# Altium schematic sheet Calibration.SchDoc
size A4; SheetNumber: 1; SheetTotal: 1
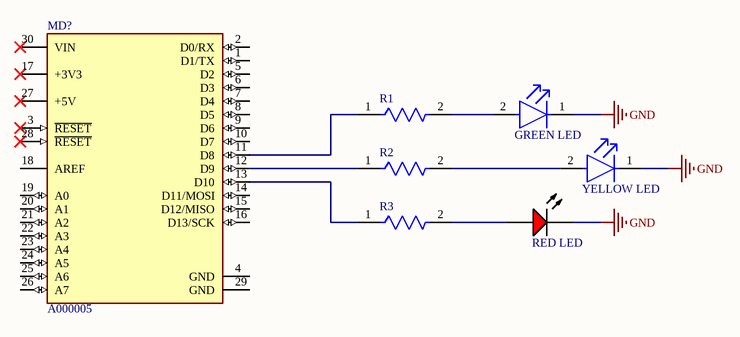
[diagram p0: Calibration.SchDoc]

## Parts
LEDG  GREEN LED  [FP-LTST-C190GKT-MFG]
LEDR  RED LED  [VISH-TLMX1100_V]
LEDY  YELLOW LED  [FP-6_541-5092_01-4-MFG]
MD?  A000005  [FP-A000005-MFG]
R1  MMA02040C1001FB300  [FP-MMA0204-MFG]  (value not drawn)
R2  MMA02040C1001FB300  [FP-MMA0204-MFG]  (value not drawn)
R3  MMA02040C1001FB300  [FP-MMA0204-MFG]  (value not drawn)

## Nets
GND: LEDG.1(C) LEDR.2(K) LEDY.1(C)
NetLEDG_2: LEDG.2(A) R1.2
NetLEDR_1: LEDR.1(A) R3.2
NetLEDY_2: LEDY.2(A) R2.2
NetMD?_11: MD?.11(D8) R1.1
NetMD?_12: MD?.12(D9) R2.1
NetMD?_13: MD?.13(D10) R3.1

Not connected (* = marked no-connect by the designer): MD? 1(D1/TX) 2(D0/RX) 3(~{RESET})* 4(GND) 5(D2) 6(D3) 7(D4) 8(D5) 9(D6) 10(D7) 14(D11/MOSI) 15(D12/MISO) 16(D13/SCK) 17(+3V3)* 18(AREF) 19(A0) 20(A1) 21(A2) 22(A3) 23(A4) 24(A5) 25(A6) 26(A7) 27(+5V)* 28(~{RESET})* 29(GND) 30(VIN)*

## Library data of the parts
LEDG = CMP-22017-000005-2: LED GREEN CLEAR CHIP SMD; Dominant Wavelength: 569nm; Reverse Voltage: 5V; Lens Color: Colorless; Viewing Angle: 130°; Voltage: 2V; Forward Current: 30mA; Power Dissipation: 100mW; Luminous Intensity: 6mcd; Number of LEDs: 1; Forward Voltage: 2.1V; Wavelength: 565nm; Test Current: 10mA; Min Operating Temperature: -55°C; Lens Style: Clear; Mount: Surface Mount; Width: 0.8mm; Packaging: Tape and Reel; Lens Transparency: Clear; Case Code (Metric): 1608; Depth: 0.8mm; Case Code (Imperial): 0603; Case/Package: 0603; Number of Pins: 2; Max Operating Temperature: 85°C; Lead Free: Lead Free; Number of Elements: 1; Length: 1.6mm; Height: 0.8mm; Package Quantity: 1; Power Rating: 100mW; Radiation Hardening: No; Illumination Color: Green; Color: Green
LEDR = CMP-1666-00027-1: LED, RED, 2.1 V, -40 to 100 degC, 2-Pin SMD (0603), RoHS, Tape and Reel; Type (Capacitors): C0G; Resistance: 100000000000 Ohm; Capacitance: 12 pF; Voltage Rating: 50 V; Tolerance: 5%; Min Operating Temperature: -55degC; REACH SVHC: No SVHC; ComponentLink2Description: Datasheet; ComponentLink1URL: http://www.vishay.com/; Width: 0.8 mm; Package Quantity: 4000; PackageReference: TLMX1100; ComponentLink2URL: http://www.vishay.com/docs/83173/tlmb1100.pdf; Case/Package: 0603; Case Code (Metric): 1608; Packaging: Tape and Reel; Pins: 2; ComponentLink1Description: Manufacturer URL; Max Operating Temperature: 125degC; Height: 0.8 mm; Length: 1.6 mm; Mount: Surface Mount; PackageDescription: 2-Pin Surface Mount Device, Body 1.6 x 0.8 mm; DatasheetVersion: Rev. 2.7, 03/2016; Case Code (Imperial): 0603; Voltage Rating (DC): 50 V; RoHSCompliant: True; Radiation Hardening: No
LEDY = CMP-02520-000001-1: LED YELLOW 0603 SMD; Manufacturer: Vishay; Manufacturer Part Number: VLMY1300-GS08; Led Orientation: Top View; Viewing Angle: 130°; Peak Emmision Wavelength: 588nm; Description: LED Uni-Color Yellow 588nm 2-Pin Chip 0603(1608Metric) T/R; Wavelength: 597nm; Luminous Intensity: 28-180mcd; Forward Voltage: 2.4V; Power Dissipation: 75mW; Forward Current: 20mA; Reverse Voltage: 5V; Octopart: https://octopart.com/vlmy1300-gs08-vishay-21709204; Temperature Range Low: -35°C; Temperature Range High: +85°C; Device Class L2: LEDs; Device Class L3: unset; RoHS: TRUE; ComponentLink2URL: https://www.vishay.com/docs/82437/vlmo1300.pdf; Category: Diode; Ambient Temperature Range High: +85°C; Ambient Temperature Range Low: -35°C; Height: 1mm; Temperature: -35°C to +85°C; Package: 6.541-5092.01-4; Lead Free: Yes; Device Class L1: Optoelectronics; Digikey Description: LED YELLOW 0603 SMD; ComponentLink2Description: Datasheet; Colour: Yellow; Automotive: No
MD? = CMP-189986-000002-1: ARDUINO NANO ATMEGA328 EVAL BRD; Number of Bits: 8; Evaluation Kit: Yes; Operating Supply Voltage: 12V; Interface: I2C; Data Bus Width: 8b; Core Architecture: AVR; Packaging: Bulk; Length: 7inch; Package Quantity: 50; Width: 5inch; REACH SVHC: No SVHC; Weight: 0.358383oz; Series: AVR® ATmega; Height: 0.25inch
R1-R3 = CMP-02407-011581-1: RES SMD 1K OHM 1% 0.4W 0204; Power Rating: 250mW; Temperature Coefficient: 50ppm/°C; Max Power Dissipation: 400mW; Voltage Rating: 150V; Operating Supply Voltage: 200V; Resistance: 1kR; Case/Package: Molded; Length: 3.6mm; Tolerance: 1%; Mount: Surface Mount; Max Operating Temperature: 125°C; Packaging: Tape and Reel; RoHS Compliant: Yes; Min Operating Temperature: -55°C; Number of Terminations: 2; Lead Free: Lead Free; Contact Plating: Tin; Features: Automotive AEC-Q200; Military Standard: Not; REACH SVHC: No SVHC; Resistor Type: Thin Film; Diameter: 1.4mm; Package Quantity: 1